# EAGLE design Occulow-Breakout (EAGLE 8.0.2)
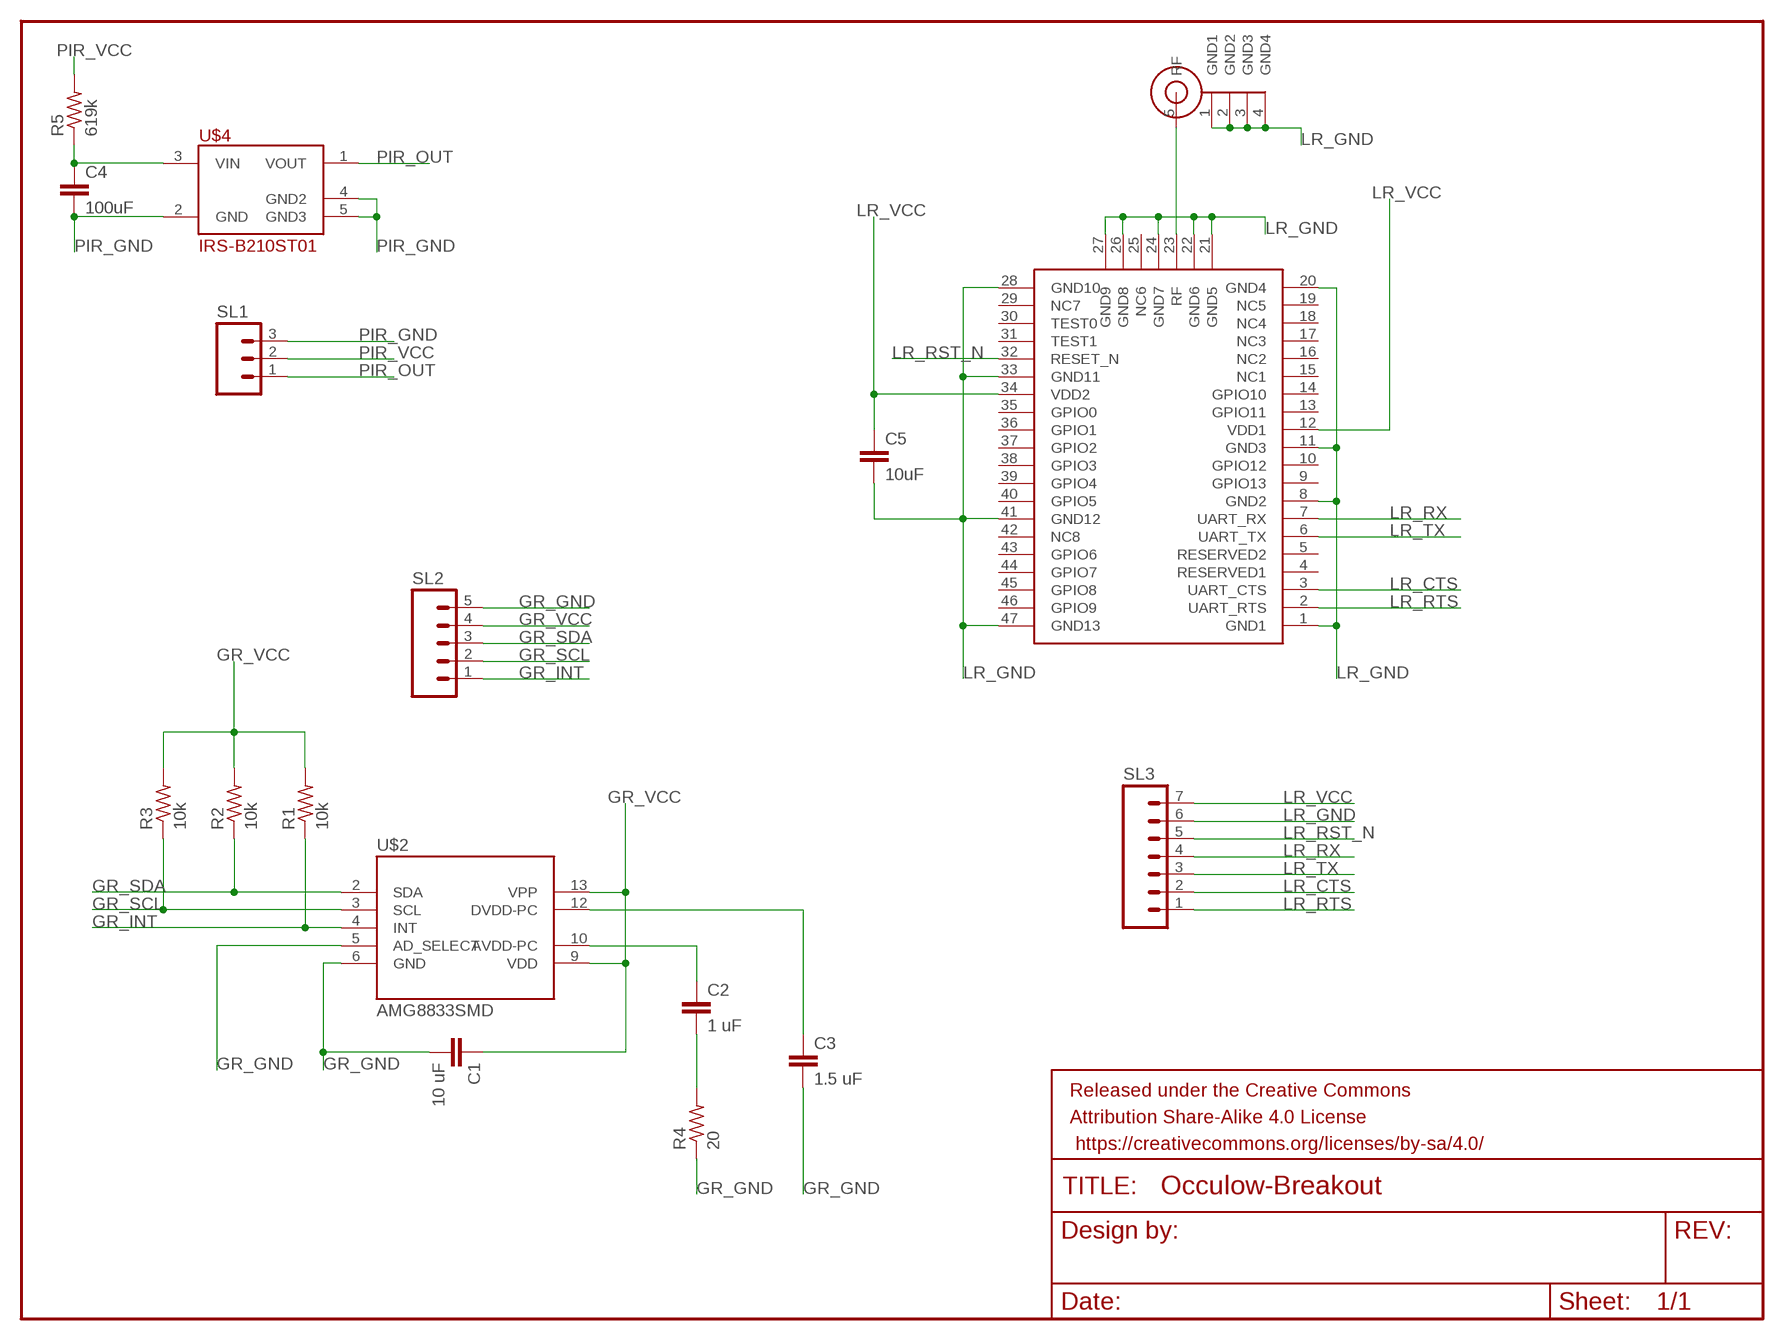
[diagram p0: schematic, sheet 1]

## Parts
C1  10 uF  C-EUC1206  [C1206]
C2  1 uF  C-EUC1206  [C1206]
C3  1.5 uF  C-EUC1206  [C1206]
C4  100uF  C-EUC1206  [C1206]
C5  10uF  C-EUC1206  [C1206]
FRAME1  FRAME-LETTER  [CREATIVE_COMMONS]
R1  10k  R-US_R1206  [R1206]
R2  10k  R-US_R1206  [R1206]
R3  10k  R-US_R1206  [R1206]
R4  20  R-US_R1206  [R1206]
R5  619k  R-US_R1206  [R1206]
SL1  M03  [03P]
SL2  M05  [05P]
SL3  M07  [07P]
U$1  RN2903  [RN2903]
U$2  AMG8833SMD  [AMG8833]
U$3  SMA-JACKFEMALE  [SMA-JACK]
U$4  IRS-B210ST01  [IRS-B210ST01]

## Nets
GR_GND: C1.2 C3.2 R4.1 SL2.5 U$2.5(AD_SELECT) U$2.6(GND)
GR_INT: R1.1 SL2.1 U$2.4(INT)
GR_SCL: R3.1 SL2.2 U$2.3(SCL)
GR_SDA: R2.1 SL2.3 U$2.2(SDA)
GR_VCC: C1.1 R1.2 R2.2 R3.2 SL2.4 U$2.9(VDD) U$2.13(VPP)
LR_CTS: SL3.2 U$1.3(UART_CTS)
LR_GND: C5.2 SL3.6 U$1.1(GND1) U$1.8(GND2) U$1.11(GND3) U$1.20(GND4) U$1.21(GND5) U$1.22(GND6) U$1.24(GND7) U$1.26(GND8) U$1.27(GND9) U$1.28(GND10) U$1.33(GND11) U$1.41(GND12) U$1.47(GND13) U$3.1(GND1) U$3.2(GND2) U$3.3(GND3) U$3.4(GND4)
LR_RST_N: SL3.5 U$1.32(RESET_N)
LR_RTS: SL3.1 U$1.2(UART_RTS)
LR_RX: SL3.4 U$1.7(UART_RX)
LR_TX: SL3.3 U$1.6(UART_TX)
LR_VCC: C5.1 SL3.7 U$1.12(VDD1) U$1.34(VDD2)
N$2: C2.1 U$2.10(AVDD-PC)
N$3: C2.2 R4.2
N$4: C3.1 U$2.12(DVDD-PC)
N$5: C4.1 R5.1 U$4.3(VIN)
PIR_GND: C4.2 SL1.3 U$4.2(GND) U$4.4(GND2) U$4.5(GND3)
PIR_OUT: SL1.1 U$4.1(VOUT)
PIR_VCC: R5.2 SL1.2
RF: U$1.23(RF) U$3.5(RF)
Unconnected: U$1.4(RESERVED1) U$1.5(RESERVED2) U$1.9(GPIO13) U$1.10(GPIO12) U$1.13(GPIO11) U$1.14(GPIO10) U$1.15(NC1) U$1.16(NC2) U$1.17(NC3) U$1.18(NC4) U$1.19(NC5) U$1.25(NC6) U$1.29(NC7) U$1.30(TEST0) U$1.31(TEST1) U$1.35(GPIO0) U$1.36(GPIO1) U$1.37(GPIO2) U$1.38(GPIO3) U$1.39(GPIO4) U$1.40(GPIO5) U$1.42(NC8) U$1.43(GPIO6) U$1.44(GPIO7) U$1.45(GPIO8) U$1.46(GPIO9)

## Library data of the parts
C1-C5 = rcl:C-EU: CAPACITOR, European symbol
FRAME1 = SparkFun-Aesthetics:FRAME-LETTER: Schematic Frame - Letter Standard 8.5x11 US Letter frame
R1-R5 = resistor:R-US_: RESISTOR, American symbol
SL1 = con-amp-quick:M03: AMP QUICK CONNECTOR; OC_FARNELL: unknown; OC_NEWARK: unknown
SL2 = con-amp-quick:M05: AMP QUICK CONNECTOR; OC_FARNELL: unknown; OC_NEWARK: unknown
SL3 = con-amp-quick:M07: AMP QUICK CONNECTOR; OC_FARNELL: unknown; OC_NEWARK: unknown
U$1 = RN2903:RN2903
U$2 = GridEye:AMG8833: AMG8833 Grid-Eye infrared sensor
U$3 = SMA-JACK:SMA-JACK: Female SMA through-hole jack. http://www.te.com/commerce/DocumentDelivery/DDEController?Action=srchrtrv&DocNm=1814832&DocType=Customer+Drawing&DocLang=English http://www.digikey.com/product-detail/en/te-connectivity-amp-connectors/5-1814832-1/A97594-ND/1755982
U$4 = PIR:IRS-B210ST01: Murata IRS-B210ST01 PIR sensor

## Board
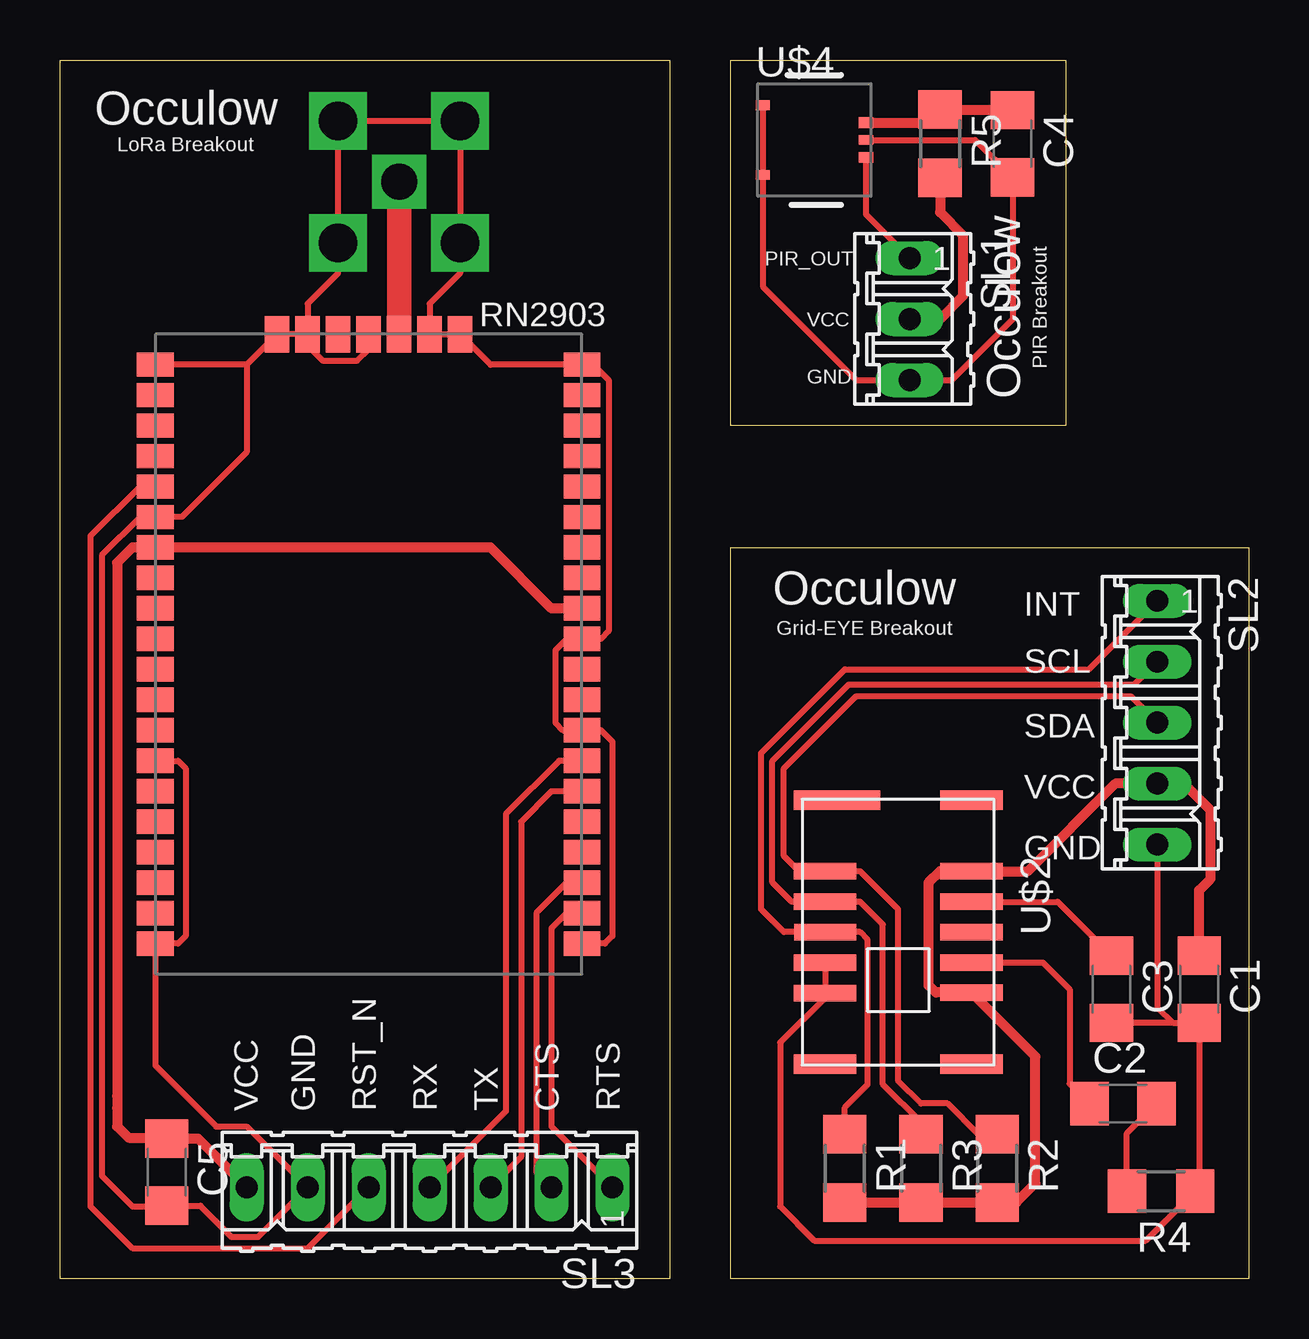
[diagram p1: board, top side]

Size 49.53 x 50.8 mm. Coordinates in mm from the lower left corner, seen from the top.
Outline: 27.94,0 27.94,30.48 49.53,30.48 49.53,0 27.94,0
Outline: 41.91,50.8 41.91,35.56 27.94,35.56 27.94,50.8 41.91,50.8
Outline: 0,0 0,50.8 25.4,50.8 25.4,0 0,0
Copper layers (1*16): Top 0.035mm / dielectric 1.5mm / Bottom 0.035mm
Design rules "default": minimum track width 10mil, minimum drill 24mil, track to track 8mil, track to pad 8mil, pad to pad 8mil, via to via 8mil, smd to smd 8mil, copper to edge 40mil, drill to drill 8mil, minimum pad ring 10mil, minimum via ring 8mil, stop-mask expansion 4mil, vias tented up to drill 0mil, thermal gap 10mil

### Footprints (pad centres in the part's own frame; a part is rotated, then mirrored left to right if it is on the bottom)
C1206 = smd 1.6 x 1.8: 1 -1.4,0; 2 1.4,0
R1206 = smd 1.6 x 1.803: 1 -1.422,0; 2 1.422,0
03P = drill 0.914 long: 1 -2.54,0; 2 0,0; 3 2.54,0
05P = drill 0.914 long: 1 -5.08,0; 2 -2.54,0; 3 0,0; 4 2.54,0; 5 5.08,0
07P = drill 0.914 long: 1 -7.62,0; 2 -5.08,0; 3 -2.54,0; 4 0,0; 5 2.54,0; 6 5.08,0; 7 7.62,0
RN2903 = smd 1.524 x 1.016: 1 8.89,-11.43; 2 8.89,-10.16; 3 8.89,-8.89; 4 8.89,-7.62; 5 8.89,-6.35; 6 8.89,-5.08; 7 8.89,-3.81; 8 8.89,-2.54; 9 8.89,-1.27; 10 8.89,0; 11 8.89,1.27; 12 8.89,2.54; 13 8.89,3.81; 14 8.89,5.08; 15 8.89,6.35; 16 8.89,7.62; 17 8.89,8.89; 18 8.89,10.16; 19 8.89,11.43; 20 8.89,12.7; 28 -8.89,12.7; 29 -8.89,11.43; 30 -8.89,10.16; 31 -8.89,8.89; 32 -8.89,7.62; 33 -8.89,6.35; 34 -8.89,5.08; 35 -8.89,3.81; 36 -8.89,2.54; 37 -8.89,1.27; 38 -8.89,0; 39 -8.89,-1.27; 40 -8.89,-2.54; 41 -8.89,-3.81; 42 -8.89,-5.08; 43 -8.89,-6.35; 44 -8.89,-7.62; 45 -8.89,-8.89; 46 -8.89,-10.16; 47 -8.89,-11.43 | smd 1.016 x 1.524: 21 3.81,13.97; 22 2.54,13.97; 23 1.27,13.97; 24 0,13.97; 25 -1.27,13.97; 26 -2.54,13.97; 27 -3.81,13.97
AMG8833 = smd 0.8 x 3.6: 1 -5.5,-2.55 | smd 0.7 x 2.6: 2 -2.54,-3.05; 3 -1.27,-3.05; 4 0,-3.04; 5 1.27,-3.05; 6 2.54,-3.05; 9 2.52,3.05; 10 1.27,3.05; 11 0,3.05; 12 -1.27,3.05; 13 -2.54,3.05 | smd 0.8 x 2.6: 7 5.5,-3.05; 8 5.5,3.05; 14 -5.5,3.05
SMA-JACK = drill 1.6 square: 1 -2.54,2.54; 2 2.54,2.54; 3 2.54,-2.54; 4 -2.54,-2.54 | drill 1.5 square: 5 0,0
IRS-B210ST01 = smd 0.6 x 0.45: 1 2.15,-0.725; 3 2.15,0.725 | smd 0.6 x 0.4: 2 2.15,0; 4 -2.15,1.45; 5 -2.15,-1.45

### Placement (x,y rotation side)
C1  47.47,12.06 270 top
C2  44.29,7.3 0 top
C3  43.81,12.06 270 top
C4  39.69,47.31 270 top
C5  4.45,4.45 270 top
FRAME1  -101.6,30.48 0 top  (outside the outline)
R1  32.7,4.6 270 top
R2  39.05,4.6 270 top
R3  35.88,4.6 270 top
R4  45.88,3.65 180 top
R5  36.67,47.31 270 top
SL1  35.4,40.01 270 top
SL2  45.72,23.18 270 top
SL3  15.4,3.81 180 top
U$1  12.86,25.4 0 top
U$2  34.92,14.45 270 top
U$3  14.13,45.72 0 top
U$4  31.43,47.47 0 top

### Tracks (layer width: path | path; a pad name or v marks a point on that pad's centre or on a via)
GR_GND
  Top 0.254: U$2.5 U$2.6 31.88,11.71 30,9.84 30,3.02 31.43,1.59 45.24,1.59 R4.1 47.47,3.82 C1.2 46.35,10.66 | 46.35,10.66 C3.2 | SL2.5 45.72,11.3 46.35,10.66
GR_INT
  Top 0.254: R1.1 32.7,7.14 33.66,8.1 33.66,14.13 33.34,14.45 U$2.4 30.16,14.45 29.21,15.4 29.21,21.91 32.7,25.4 42.86,25.4 SL2.1
GR_SCL
  Top 0.254: R3.1 35.88,6.51 34.29,8.1 34.29,14.76 33.34,15.72 U$2.3 30.48,15.72 29.69,16.51 29.69,21.59 32.86,24.77 44.77,24.77 SL2.2
GR_SDA
  Top 0.254: R2.1 38.27,6.03 36.99,7.3 35.88,7.3 34.92,8.26 34.92,15.4 33.34,16.99 U$2.2 30.8,16.99 30.16,17.62 30.16,21.27 33.18,24.29 44.61,24.29 SL2.3
GR_VCC
  Top 0.406: R1.2 R3.2 R2.2 39.85,3.18 40.64,3.97 40.64,9.26 U$2.9 36.49,11.93 36.2,12.22 36.2,16.51 36.67,16.99 U$2.13 40.32,16.99 43.97,20.64 SL2.4 46.83,20.64 47.94,19.53 47.94,16.67 47.47,16.19 C1.1
LR_CTS
  Top 0.254: U$1.3 21.11,16.51 19.84,15.24 19.84,4.45 SL3.2
LR_GND
  Top 0.254: U$1.1 22.7,13.97 23.02,14.29 23.02,22.38 22.54,22.86 U$1.8 20.95,22.86 20.64,23.18 20.64,26.19 21.11,26.67 U$1.11 22.54,26.67 22.86,26.99 22.86,37.47 22.23,38.1 U$1.20 17.94,38.1 U$1.21 U$1.22 15.4,40.64 16.67,41.91 U$3.3 U$3.2 U$3.1 U$3.4 11.59,41.91 10.32,40.64 U$1.26 | U$1.26 U$1.27 7.78,38.1 | U$1.26 10.32,38.89 10.95,38.26 12.38,38.26 12.86,38.73 U$1.24 | 7.78,38.1 U$1.28 | U$1.41 4.92,21.59 5.24,21.27 5.24,14.29 4.92,13.97 U$1.47 3.97,8.89 6.51,6.35 7.78,6.35 SL3.6 8.26,1.75 7.14,1.75 5.84,3.04 C5.2 4.42,3.02 3.02,3.02 1.75,4.29 1.75,5.08 | 7.78,38.1 7.78,34.45 5.08,31.75 U$1.33 3.33,31.75 1.75,30.16 1.75,5.08 | 1.75,5.08 1.75,4.95
LR_RST_N
  Top 0.254: U$1.32 3.33,33.02 1.27,30.96 1.27,3.02 3.02,1.27 10.32,1.27 SL3.5
LR_RTS
  Top 0.254: U$1.2 21.11,15.24 20.48,14.61 20.48,6.35 SL3.1
LR_RX
  Top 0.254: U$1.7 20.8,21.59 18.57,19.37 18.57,6.99 SL3.4
LR_TX
  Top 0.254: U$1.6 20.48,20.32 19.21,19.05 19.21,5.08 SL3.3
LR_VCC
  Top 0.406: U$1.12 20.48,27.94 17.94,30.48 U$1.34 3.02,30.48 2.38,29.84 2.38,7.62 | 2.38,7.62 2.38,7.12 | 2.38,7.62 2.38,6.35 2.86,5.87 4.42,5.87 C5.1 5.74,5.84 SL3.7
N$2
  Top 0.254: U$2.10 40.96,13.18 42.07,12.06 42.07,8.12 C2.1
N$3
  Top 0.254: R4.2 44.46,6.07 C2.2
N$4
  Top 0.254: U$2.12 41.56,15.72 C3.1
N$5
  Top 0.406: U$4.3 36.13,48.19 R5.1 39.67,48.73 C4.1
PIR_GND
  Top 0.254: U$4.4 U$4.5 29.28,41.36 33.18,37.47 SL1.3 37.15,37.47 39.69,40.01 C4.2 38.13,47.47 U$4.2
PIR_OUT
  Top 0.254: U$4.1 33.58,44.36 SL1.1
PIR_VCC
  Top 0.406: R5.2 36.67,44.45 37.62,43.5 37.62,40.96 36.67,40.01 SL1.2
RF
  Top 1.016: U$1.23 U$3.5

### Text on the board
tPlace: Occulow | LoRa Breakout | PIR_OUT | RN2903 | VCC | PIR Breakout | GND | Occulow | Occulow | INT | Grid-EYE Breakout | SCL | SDA | VCC | GND | VCC | GND | RST_N | RX | TX | CTS | RTS